# EAGLE design xbee5vmkadapter (EAGLE 5.11)
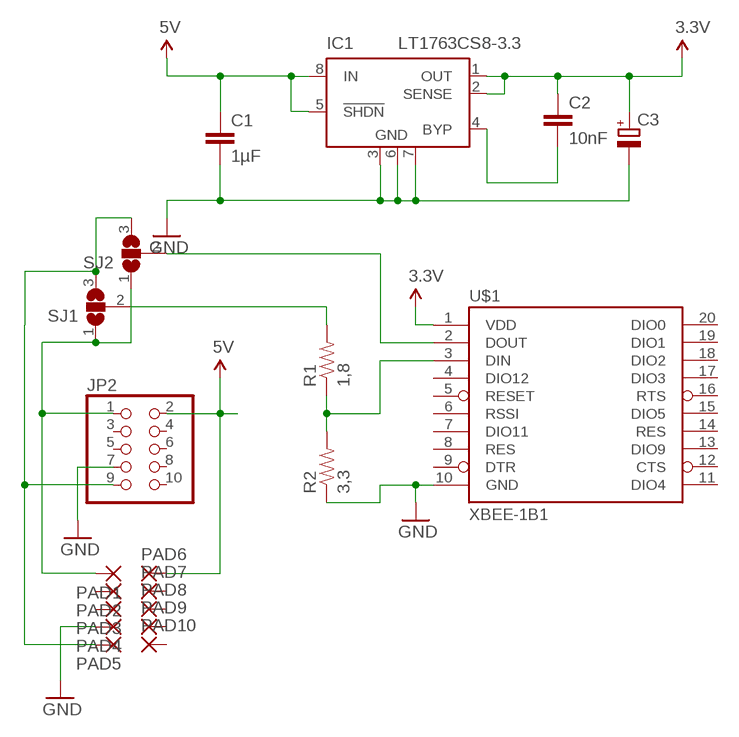
[diagram p0: schematic, sheet 1]

## Parts
C1  1µF  CAP0805  [0805]
C2  10nF  CAP0805  [0805]
C3  CPOL-EUSMCC  [SMC_C]
IC1  LT1763CS8-3.3  [SOIC8]
JP2  PINHD-2X05_2.54  [2X05]
PAD1  SMD2  [SMD1,27-2,54]
PAD2  SMD2  [SMD1,27-2,54]
PAD3  SMD2  [SMD1,27-2,54]
PAD4  SMD2  [SMD1,27-2,54]
PAD5  SMD2  [SMD1,27-2,54]
PAD6  SMD2  [SMD1,27-2,54]
PAD7  SMD2  [SMD1,27-2,54]
PAD8  SMD2  [SMD1,27-2,54]
PAD9  SMD2  [SMD1,27-2,54]
PAD10  SMD2  [SMD1,27-2,54]
R1  1,8  RESISTOR  [0805]
R2  3,3  RESISTOR  [0805]
SJ1  SJ2W  [SJ_2]
SJ2  SJ2W  [SJ_2]
U$1  XBEE-1B1  [XBEE-1]

## Nets
3.3V: C2.1 C3.+ IC1.1(OUT) IC1.2(SENSE) U$1.1(VDD)
5V: C1.1 IC1.5(!SHDN) IC1.8(IN) JP2.2 PAD6.1(P)
GND: C1.2 C3.- IC1.3(GND) IC1.6(GND) IC1.7(GND) JP2.7 PAD4.1(P) R2.1 U$1.10(GND)
N$1: R1.1 R2.2 U$1.3(DIN)
N$2: JP2.1 PAD1.1(P) SJ1.1 SJ2.1
N$3: JP2.9 PAD5.1(P) SJ1.3 SJ2.3
N$4: C2.2 IC1.4(BYP)
N$5: SJ2.2 U$1.2(DOUT)
N$8: R1.2 SJ1.2
Unconnected: JP2.3 JP2.4 JP2.5 JP2.6 JP2.8 JP2.10 PAD2.1(P) PAD3.1(P) PAD7.1(P) PAD8.1(P) PAD9.1(P) PAD10.1(P) U$1.4(DIO12) U$1.5(RESET) U$1.6(RSSI) U$1.7(DIO11) U$1.8(RES) U$1.9(DTR) U$1.11(DIO4) U$1.12(CTS) U$1.13(DIO9) U$1.14(RES) U$1.15(DIO5) U$1.16(RTS) U$1.17(DIO3) U$1.18(DIO2) U$1.19(DIO1) U$1.20(DIO0)

## Library data of the parts
C1 C2 = SparkFun:CAP: Capacitor Standard 0603 ceramic capacitor, and 0.1" leaded capacitor.
C3 = resistor:CPOL-EU: POLARIZED CAPACITOR, European symbol
IC1 = linear-technology:LT1763CS8: 500mA, Low Noise, LDO Micropower Regulators Source: http://cds.linear.com/docs/Datasheet/1763ff.pdf
JP2 = pinhead-2:PINHD-2X05: PIN HEADER
PAD1-PAD10 = wirepad:SMD2: SMD PAD
R1 R2 = SparkFun:RESISTOR: Resistor Basic schematic elements and footprints for 0603, 1206, and PTH 1/10th watt (small) resistors.
SJ1 SJ2 = jumper:SJ2W: SMD solder JUMPER
U$1 = SparkFun:XBEE-1

## Board
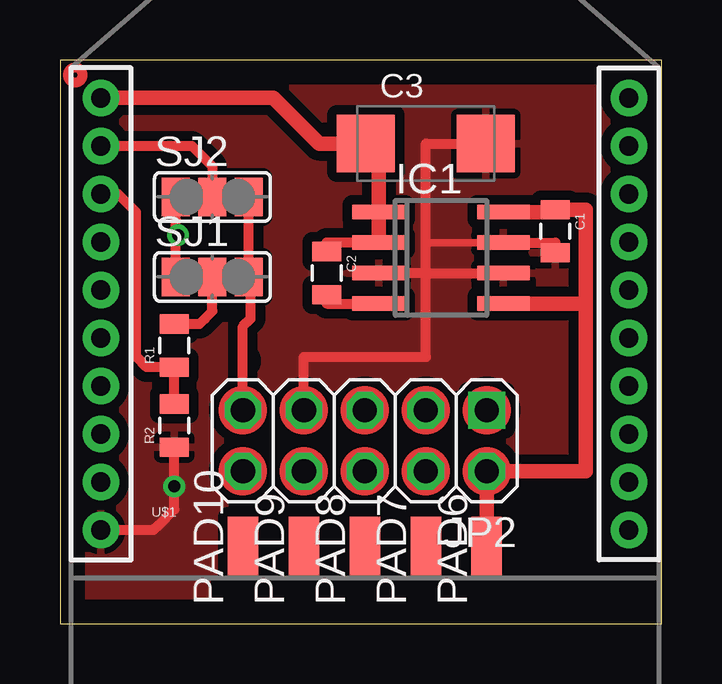
[diagram p1: board, top side]
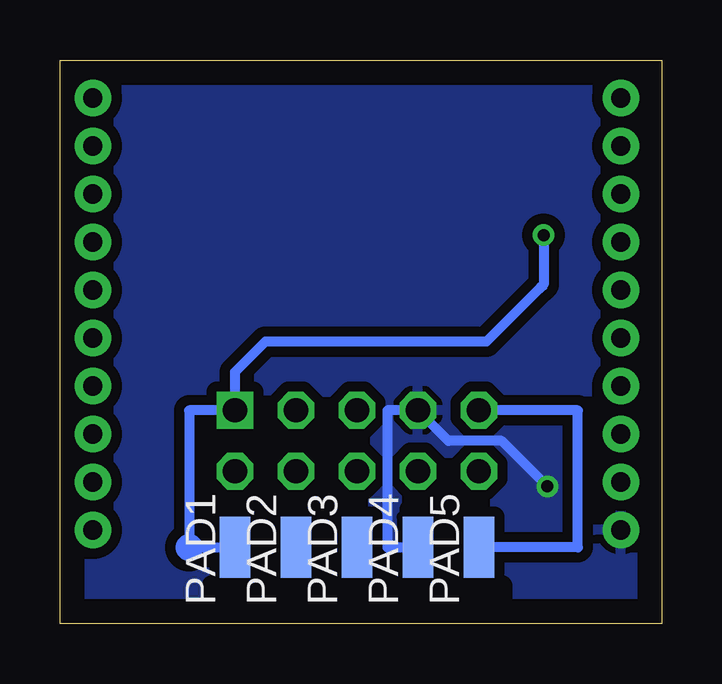
[diagram p2: board, bottom side, seen from below]

Size 25.07 x 23.49 mm. Coordinates in mm from the lower left corner, seen from the top.
Outline: 0,0 25.07,0 25.07,23.49 0,23.49 0,0
Copper layers (1*16): Top 0.035mm / dielectric 1.5mm / Bottom 0.035mm
Design rules "default": minimum track width 10mil, minimum drill 24mil, track to track 8mil, track to pad 8mil, pad to pad 8mil, via to via 8mil, smd to smd 8mil, copper to edge 40mil, drill to drill 8mil, minimum pad ring 10mil, minimum via ring 8mil, stop-mask expansion 4mil, vias tented up to drill 0mil, thermal gap 10mil
tRestrict: 6 lines
bRestrict: 6 lines

### Footprints (pad centres in the part's own frame; a part is rotated, then mirrored left to right if it is on the bottom)
0805 = smd 0.8 x 1.2: 1 -0.9,0; 2 0.9,0
SMC_C = smd 2.4 x 2.4: + -2.5,0; - 2.5,0
SOIC8 = smd 0.6 x 2.2: 1 -1.905,-2.6; 2 -0.635,-2.6; 3 0.635,-2.6; 4 1.905,-2.6; 5 1.905,2.6; 6 0.635,2.6; 7 -0.635,2.6; 8 -1.905,2.6
2X05 = drill 1.016 square: 1 -5.08,-1.27 | drill 1.016 octagon: 2 -5.08,1.27; 3 -2.54,-1.27; 4 -2.54,1.27; 5 0,-1.27; 6 0,1.27; 7 2.54,-1.27; 8 2.54,1.27; 9 5.08,-1.27; 10 5.08,1.27
SMD1,27-2,54 = smd 1.27 x 2.54: 1 0,0
SJ_2 = smd 1.168 x 1.6: 1 -1.524,0; 2 0,0; 3 1.524,0
XBEE-1 = drill 0.8 pad 1.524 round: 1 -11,20; 2 -11,18; 3 -11,16; 4 -11,14; 5 -11,12; 6 -11,10; 7 -11,8; 8 -11,6; 9 -11,4; 10 -11,2; 11 11,2; 12 11,4; 13 11,6; 14 11,8; 15 11,10; 16 11,12; 17 11,14; 18 11,16; 19 11,18; 20 11,20

### Placement (x,y rotation side)
C1  20.64,16.35 270 top
C2  11.11,14.61 270 top
C3  15.24,20 0 top
IC1  15.87,15.24 270 top
JP2  12.7,7.62 180 top
PAD1  17.78,3.18 0 bottom
PAD2  15.24,3.18 0 bottom
PAD3  12.7,3.18 0 bottom
PAD4  10.16,3.18 0 bottom
PAD5  7.62,3.18 0 bottom
PAD6  17.78,3.18 0 top
PAD7  15.24,3.18 0 top
PAD8  12.7,3.18 0 top
PAD9  10.16,3.18 0 top
PAD10  7.62,3.18 0 top
R1  4.76,11.59 90 top
R2  4.76,8.25 90 top
SJ1  6.35,14.45 0 top
SJ2  6.35,17.78 0 top
U$1  12.7,1.91 0 top

### Tracks (layer width: path | path; a pad name or v marks a point on that pad's centre or on a via)
3.3V
  Top 0.406: C3.+ 13.28,19.05 | IC1.2 11.11,15.88 C2.1 | U$1.1 1.75,21.86
  Top 0.61: 13.28,19.05 IC1.1 IC1.2 | C3.+ 10.79,20 9.21,21.59 8.89,21.9 U$1.1
5V
  Top 0.406: 17.78,13.33 IC1.5 | C1.1 20.43,17.14 | 17.78,13.33 21.91,13.33 17.78,13.33
  Top 0.61: 20.43,17.14 IC1.8 | C1.1 21.91,17.25 21.91,13.33 | 21.91,13.33 17.78,13.33 | PAD6.1 JP2.2 21.91,6.35 21.91,13.33
GND  (via drill 0.5)
  Top 0.305: 15.24,15.88 IC1.7
  Top 0.406: IC1.7 20.64,15.88 C1.2 | C3.- 15.24,20 15.24,15.88 15.24,14.61 | 15.24,14.61 IC1.6 | 15.24,14.61 IC1.3 15.24,14.61 | 15.24,14.61 15.24,11.11 11.43,11.11 | 10.16,11.11 11.43,11.11 | 10.16,11.11 11.43,11.11 | JP2.7 10.16,11.11 | U$1.10 3.9,3.9 4.13,4.13 4.76,4.76 v4.76,5.71 R2.1
  Bottom 0.406: PAD4.1 11.43,3.18 11.43,8.89 JP2.7 8.89,7.62 6.67,7.62 v4.76,5.71
  pour Bottom (isolate 0.432): 0,23.5 25.4,23.5 25.4,0 0,0
  pour Top (isolate 0.406): 0,23.5 25.4,23.5 25.4,0 0,0
N$1
  Top 0.406: U$1.3 2.41,17.9 2.86,17.46 3.18,17.14 3.18,14.92 3.18,11.11 3.6,10.69 R1.1 R2.2
N$2  (via drill 0.5)
  Top 0.406: 4.83,16.83 SJ2.1 4.83,16.83 | SJ1.1 4.83,15.88 | 4.83,15.88 4.83,16.83 | v4.92,16.19 4.83,16.1 4.83,15.88
  Bottom 0.406: PAD1.1 19.69,3.18 19.69,8.89 | JP2.1 19.69,8.89 | JP2.1 19.69,8.89 | JP2.1 17.78,10.48 16.51,11.75 7.3,11.75 5.08,13.97 4.92,14.13 v4.92,16.19
N$3
  Top 0.406: SJ2.3 SJ1.3 7.94,14.38 7.94,12.7 7.62,12.38 JP2.9 7.56,8.89
  Bottom 0.406: PAD5.1 3.49,3.18 3.49,8.89 JP2.9
N$4
  Top 0.406: C2.2 11.11,13.33 IC1.4
N$5
  Top 0.406: SJ2.2 6.35,19.05 5.71,19.68 5.49,19.9 U$1.2
N$8
  Top 0.406: R1.2 5.82,12.49 6.03,12.7 6.35,13.02 SJ1.2
(copper drawn outside any net)
  shapes: Bottom circle x1, Top circle x12

### Text on the board
bStop: Mikrokopter-Xbee | Adapter v1.1 | seb@exse.net